# Altium schematic sheet MCU.SchDoc
size A3; DocumentNumber: 2; SheetNumber: 2; SheetTotal: 4
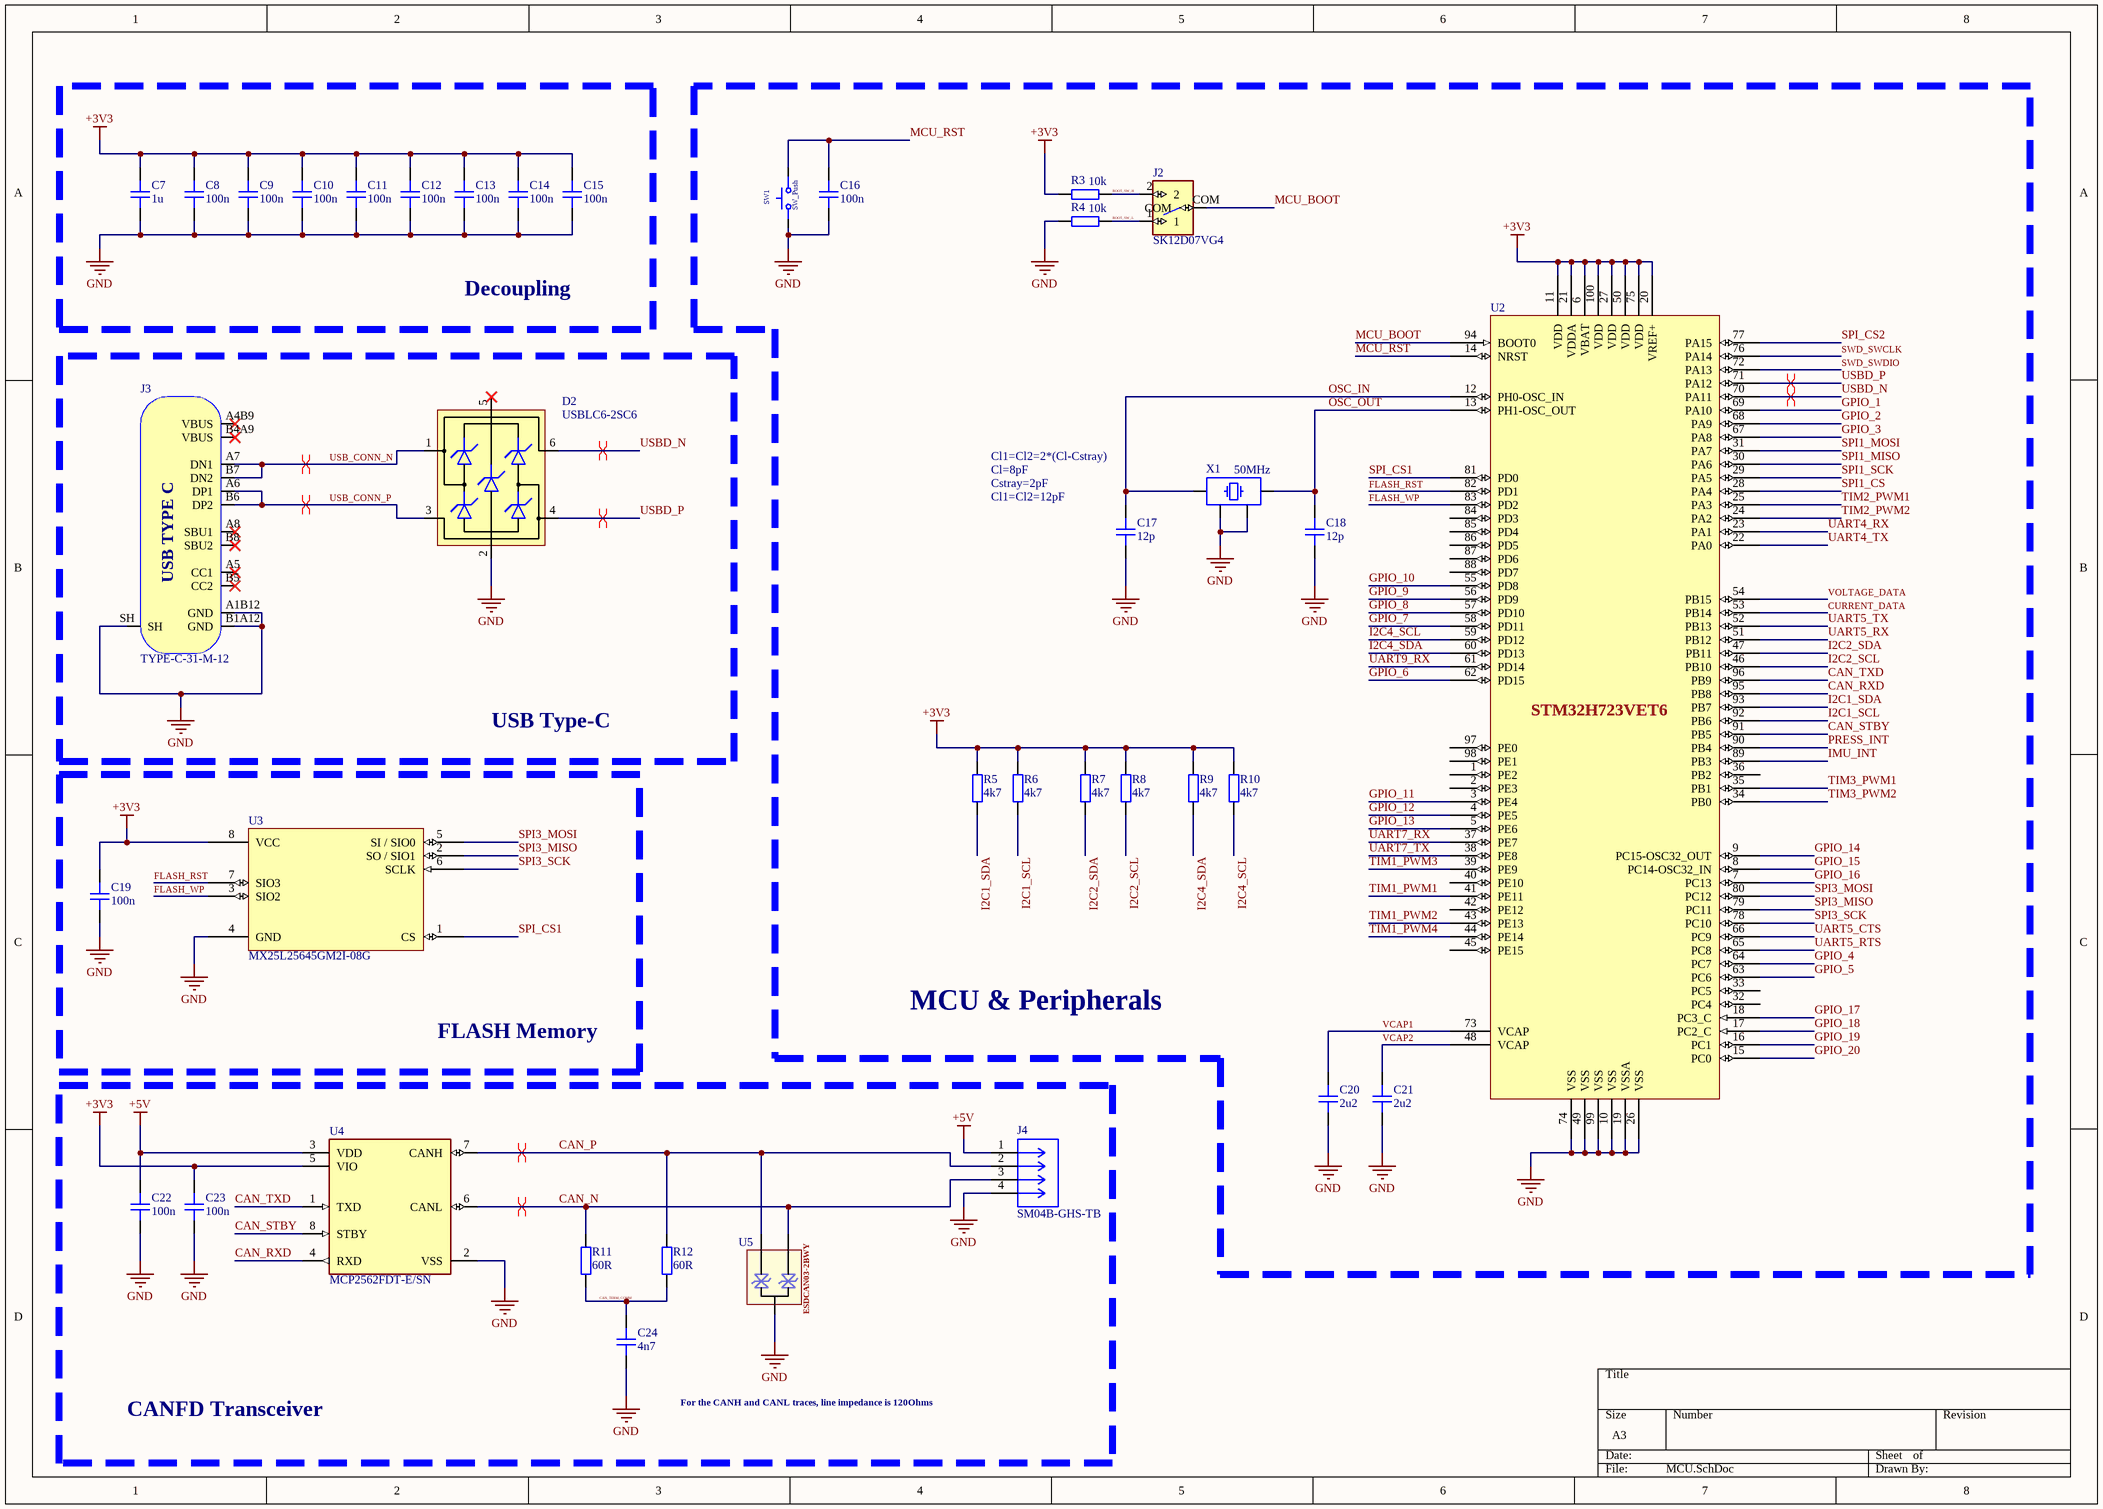
[diagram p0: MCU.SchDoc]

## Parts
C7  1u  [CAP_0402]
C8  100n  [CAP_0402]
C9  100n  [CAP_0402]
C10  100n  [CAP_0402]
C11  100n  [CAP_0402]
C12  100n  [CAP_0402]
C13  100n  [CAP_0402]
C14  100n  [CAP_0402]
C15  100n  [CAP_0402]
C16  100n  [CAP_0402]
C17  12p  [CAP_0402]
C18  12p  [CAP_0402]
C19  100n  [CAP_0402]
C20  2u2  [CAP_0402]
C21  2u2  [CAP_0402]
C22  100n  [CAP_0402]
C23  100n  [CAP_0402]
C24  4n7  [CAP_0402]
D2  USBLC6-2SC6  [SOT-23-6]
J2  SK12D07VG4  [SK12D07VG4]
J3  TYPE-C-31-M-12  [TYPE-C-31-M-12]
J4  SM04B-GHS-TB  [CONN_SM04B-GHS-TB_JST]
R3  10k  [RES_0402]
R4  10k  [RES_0402]
R5  4k7  [RES_0402]
R6  4k7  [RES_0402]
R7  4k7  [RES_0402]
R8  4k7  [RES_0402]
R9  4k7  [RES_0402]
R10  4k7  [RES_0402]
R11  60R  [RES_0402]
R12  60R  [RES_0402]
SW1  SW_Push  [4-PIN BUTTON]
U2  STM32H723VET6  [LQFP100]
U3  MX25L25645GM2I-08G  [SOP8]
U4  MCP2562FDT-E/SN  [FP-C04-057-SN-MFG]
U5  ESDCAN03-2BWY  [SOT65P210X110-3N]
X1  50MHz  [XTAL_3225]

## Blocks framed on the sheet
Decoupling: C7-C15
MCU & Peripherals: C16-C18 C20 C21 J2 R3-R10 SW1 U2 X1
USB Type-C: D2 J3
FLASH Memory: C19 U3
CANFD Transceiver: C22-C24 J4 R11 R12 U4 U5

## Nets
+3V3: C7.2 C8.2 C9.2 C10.2 C11.2 C12.2 C13.2 C14.2 C15.2 C19.2 C23.2 R3.1 R5.2 R6.2 R7.2 R8.2 R9.2 R10.2 U2.6(VBAT) U2.11(VDD) U2.20(VREF+) U2.21(VDDA) U2.27(VDD) U2.50(VDD) U2.75(VDD) U2.100(VDD) U3.8(VCC) U4.5(VIO)
+5V: C22.2 J4.1 U4.3(VDD)
GND: C7.1 C8.1 C9.1 C10.1 C11.1 C12.1 C13.1 C14.1 C15.1 C16.1 C17.1 C18.1 C19.1 C20.1 C21.1 C22.1 C23.1 C24.1 D2.2(GND) J3.A1B12(GND) J3.B1A12(GND) J3.SH J4.4 R4.1 SW1.1 U2.10(VSS) U2.19(VSSA) U2.26(VSS) U2.49(VSS) U2.74(VSS) U2.99(VSS) U3.4(GND) U4.2(VSS) U5.3 X1.2 X1.4
BOOT_SW_H: J2.2 R3.2
BOOT_SW_L: J2.1 R4.2
CAN_N: J4.3 R11.2 U4.6(CANL) U5.2
CAN_P: J4.2 R12.2 U4.7(CANH) U5.1
CAN_RXD: U2.95(PB8) U4.4(RXD)
CAN_STBY: U2.91(PB5) U4.8(STBY)
CAN_TERM_COMM: C24.2 R11.1 R12.1
CAN_TXD: U2.96(PB9) U4.1(TXD)
CURRENT_DATA: U2.53(PB14)
FLASH_RST: U2.82(PD1) U3.7(SIO3)
FLASH_WP: U2.83(PD2) U3.3(SIO2)
GPIO_1: U2.69(PA10)
GPIO_2: U2.68(PA9)
GPIO_3: U2.67(PA8)
GPIO_4: U2.64(PC7)
GPIO_5: U2.63(PC6)
GPIO_6: U2.62(PD15)
GPIO_7: U2.58(PD11)
GPIO_8: U2.57(PD10)
GPIO_9: U2.56(PD9)
GPIO_10: U2.55(PD8)
GPIO_11: U2.3(PE4)
GPIO_12: U2.4(PE5)
GPIO_13: U2.5(PE6)
GPIO_14: U2.9(PC15-OSC32_OUT)
GPIO_15: U2.8(PC14-OSC32_IN)
GPIO_16: U2.7(PC13)
GPIO_17: U2.18(PC3_C)
GPIO_18: U2.17(PC2_C)
GPIO_19: U2.16(PC1)
GPIO_20: U2.15(PC0)
I2C1_SCL: R6.1 U2.92(PB6)
I2C1_SDA: R5.1 U2.93(PB7)
I2C2_SCL: R8.1 U2.46(PB10)
I2C2_SDA: R7.1 U2.47(PB11)
I2C4_SCL: R10.1 U2.59(PD12)
I2C4_SDA: R9.1 U2.60(PD13)
IMU_INT: U2.89(PB3)
MCU_BOOT: J2.COM U2.94(BOOT0)
MCU_RST: C16.2 SW1.2 U2.14(NRST)
OSC_IN: C17.2 U2.12(PH0-OSC_IN) X1.1
OSC_OUT: C18.2 U2.13(PH1-OSC_OUT) X1.3
PRESS_INT: U2.90(PB4)
SPI1_CS: U2.28(PA4)
SPI1_MISO: U2.30(PA6)
SPI1_MOSI: U2.31(PA7)
SPI1_SCK: U2.29(PA5)
SPI3_MISO: U2.79(PC11) U3.2(SO_/_SIO1)
SPI3_MOSI: U2.80(PC12) U3.5(SI_/_SIO0)
SPI3_SCK: U2.78(PC10) U3.6(SCLK)
SPI_CS1: U2.81(PD0) U3.1(CS)
SPI_CS2: U2.77(PA15)
SWD_SWCLK: U2.76(PA14)
SWD_SWDIO: U2.72(PA13)
TIM1_PWM1: U2.41(PE11)
TIM1_PWM2: U2.43(PE13)
TIM1_PWM3: U2.39(PE9)
TIM1_PWM4: U2.44(PE14)
TIM2_PWM1: U2.25(PA3)
TIM2_PWM2: U2.24(PA2)
TIM3_PWM1: U2.35(PB1)
TIM3_PWM2: U2.34(PB0)
UART4_RX: U2.23(PA1)
UART4_TX: U2.22(PA0)
UART5_CTS: U2.66(PC9)
UART5_RTS: U2.65(PC8)
UART5_RX: U2.51(PB12)
UART5_TX: U2.52(PB13)
UART7_RX: U2.37(PE7)
UART7_TX: U2.38(PE8)
UART9_RX: U2.61(PD14)
USB_CONN_N: D2.1(IO1) J3.A7(DN1) J3.B7(DN2)
USB_CONN_P: D2.3(IO2) J3.A6(DP1) J3.B6(DP2)
USBD_N: D2.6(IO1) U2.70(PA11)
USBD_P: D2.4(IO2) U2.71(PA12)
VCAP1: C20.2 U2.73(VCAP)
VCAP2: C21.2 U2.48(VCAP)
VOLTAGE_DATA: U2.54(PB15)

Not connected (* = marked no-connect by the designer): D2 5(VBUS)*; J3 A4B9(VBUS)* A5(CC1)* A8(SBU1)* B4A9(VBUS)* B5(CC2)* B8(SBU2)*; U2 1(PE2) 2(PE3) 32(PC4) 33(PC5) 36(PB2) 40(PE10) 42(PE12) 45(PE15) 84(PD3) 85(PD4) 86(PD5) 87(PD6) 88(PD7) 97(PE0) 98(PE1)

## Layout directives
differential pair: CAN_N, CAN_P, USB_CONN_N, USB_CONN_P, USBD_N, USBD_P

## Notes on the sheet
- Cl1=Cl2=2*(Cl-Cstray)
- Cl=8pF
- Cstray=2pF
- Cl1=Cl2=12pF
- For the CANH and CANL traces, line impedance is 120Ohms
- (in symbol TYPE-C-31-M-12) USB TYPE C

## Library data of the parts
C7-C24 = CAP_0402: Capacitor SMD 0402; Manufacturer: *; Manufacturer Part Number: *; Distributor Link: *; LCSC: *; Rating: *; Dielectric: *
D2 = USBLC6-2SC6: Low-Capacitance ESD Protection USB; Manufacturer: STMicroelectronics; Manufacturer Part Number: USBLC6-2SC6; Distributor Link: https://www.mouser.de/ProductDetail/STMicroelectronics/USBLC6-2SC6?qs=po45yt2pPpu%2FhNIlwQdTlg%3D%3D
J2 = SK12D07VG4: Switch Slide ON ON SPDT Side Slide 0.3A 30VDC PC Pins Bracket Mount/Through Hole Bulk; MF: C&K; SnapEDA_Link: https://www.snapeda.com/parts/SK12D07VG4/C%2526K/view-part/?ref=snap; Package: None; Value: *; MP: SK12D07VG4; Check_prices: https://www.snapeda.com/parts/SK12D07VG4/C%2526K/view-part/?ref=eda
J3 = TYPE-C-31-M-12: USB Type C Connector Horizontal SMT; Manufacturer: Koren Hroparts; Manufacturer Part Number: TYPE-C-31-M-12
J4 = SM04B-GHS-TB: Connector Header Surface Mount, Right Angle 4 position 0.049 (1.25mm); MF: JST Sales; SnapEDA_Link: https://www.snapeda.com/parts/SM04B-GHS-TB/JST/view-part/?ref=snap; Package: None; Value: *; MP: SM04B-GHS-TB; Check_prices: https://www.snapeda.com/parts/SM04B-GHS-TB/JST/view-part/?ref=eda
R3-R12 = RES_0402: Resistor SMD 0402; Manufacturer: *; Manufacturer Part Number: *; Distributor Link: *; LCSC: *
SW1 = Push Switch
U2 = STM32H723VET6: Arm® Cortex®-M7 32-bit 550 MHz MCU, up to 1 MB flash, 564 KB / RAM, Ethernet, USB, 3x FDCAN, Graphics, 2x 16-bit ADCs
U3 = MX25L25673GM2I-08G: FLASH - NOR Memory IC 256Mbit SPI 120 MHz 8-SOP
U4 = CMP-06279-000005-1: IC TRANSCEIVER 1/1 8SOIC; Operating Supply Current: 70mA; Data Rate: 8Mbps; Number of Transceivers: 1; Receiver Hysteresis: 200mV; Max Supply Voltage: 5.5V; Min Supply Voltage: 4.5V; Weight: 0.019048oz; Package Quantity: 3300; Case/Package: SOIC; Mount: Surface Mount; Max Operating Temperature: 125°C; Min Operating Temperature: -40°C; Packaging: Tape and Reel; Number of Pins: 8
X1 = TSX-3225_24.0000MF15X-AC: WURTH 830108207809; Manufacturer: Epson; Manufacturer Part Number: TSX-3225 24.0000MF15X-AC